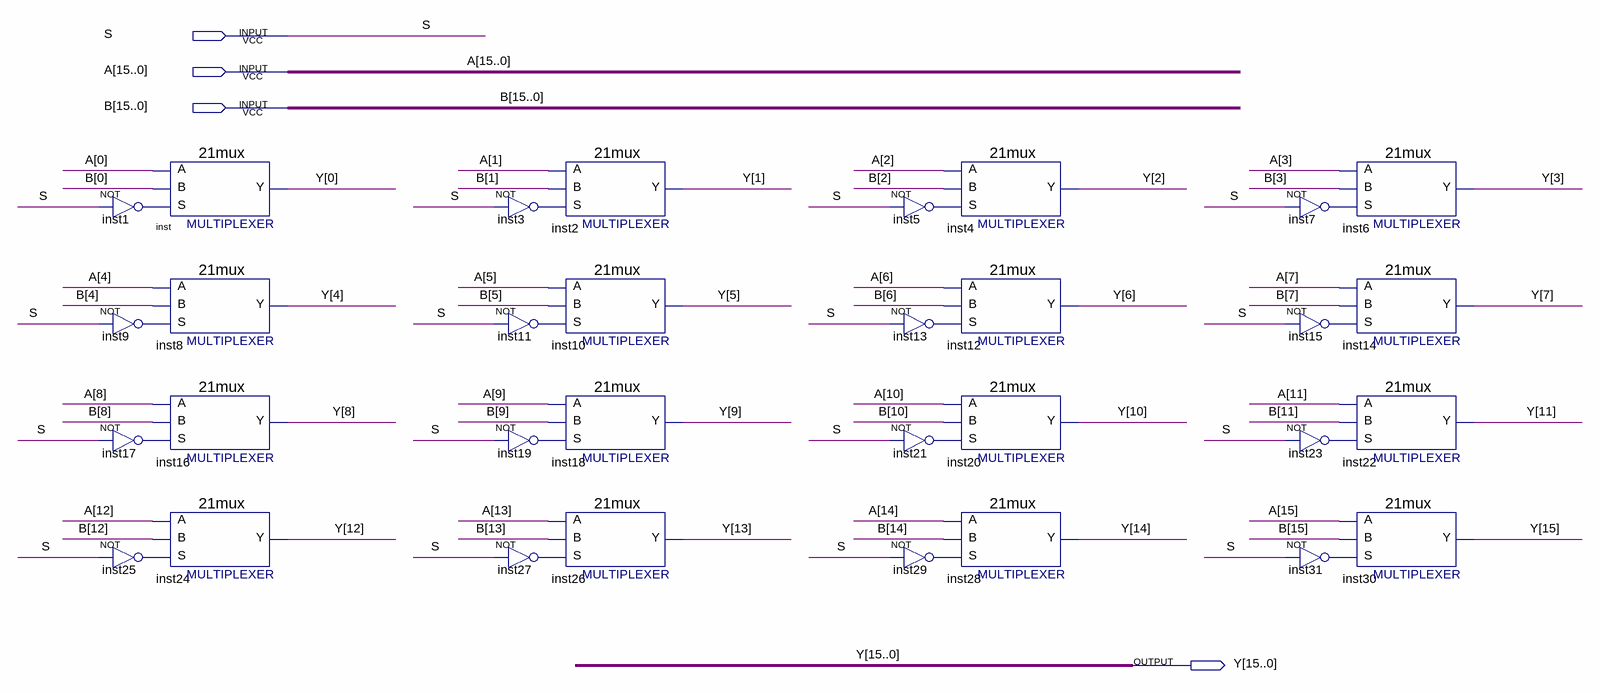
[diagram p0: schematic sheet]
// Quartus schematic mux21_16bit.bdf as structural Verilog: 32 symbols, 4 pins
module mux21_16bit (
  input  S,
  input  [15:0] A,
  input  [15:0] B,
  output [15:0] Y
);

  wire inst1_out, inst3_out, inst5_out, inst7_out, inst9_out, inst11_out, inst13_out, inst15_out, inst17_out,
       inst19_out, inst21_out, inst23_out, inst25_out, inst27_out, inst29_out, inst31_out;

  not inst1 (inst1_out, S);
  not inst9 (inst9_out, S);
  not inst17 (inst17_out, S);
  not inst25 (inst25_out, S);
  \21mux  inst (.S(inst1_out), .B(B[0]), .A(A[0]), .Y(Y[0]));
  \21mux  inst8 (.S(inst9_out), .B(B[4]), .A(A[4]), .Y(Y[4]));
  \21mux  inst16 (.S(inst17_out), .B(B[8]), .A(A[8]), .Y(Y[8]));
  \21mux  inst24 (.S(inst25_out), .B(B[12]), .A(A[12]), .Y(Y[12]));
  not inst3 (inst3_out, S);
  not inst11 (inst11_out, S);
  not inst19 (inst19_out, S);
  not inst27 (inst27_out, S);
  \21mux  inst2 (.S(inst3_out), .B(B[1]), .A(A[1]), .Y(Y[1]));
  \21mux  inst10 (.S(inst11_out), .B(B[5]), .A(A[5]), .Y(Y[5]));
  \21mux  inst18 (.S(inst19_out), .B(B[9]), .A(A[9]), .Y(Y[9]));
  \21mux  inst26 (.S(inst27_out), .B(B[13]), .A(A[13]), .Y(Y[13]));
  not inst5 (inst5_out, S);
  not inst13 (inst13_out, S);
  not inst21 (inst21_out, S);
  not inst29 (inst29_out, S);
  \21mux  inst4 (.S(inst5_out), .B(B[2]), .A(A[2]), .Y(Y[2]));
  \21mux  inst12 (.S(inst13_out), .B(B[6]), .A(A[6]), .Y(Y[6]));
  \21mux  inst20 (.S(inst21_out), .B(B[10]), .A(A[10]), .Y(Y[10]));
  \21mux  inst28 (.S(inst29_out), .B(B[14]), .A(A[14]), .Y(Y[14]));
  not inst7 (inst7_out, S);
  not inst15 (inst15_out, S);
  not inst23 (inst23_out, S);
  not inst31 (inst31_out, S);
  \21mux  inst6 (.S(inst7_out), .B(B[3]), .A(A[3]), .Y(Y[3]));
  \21mux  inst14 (.S(inst15_out), .B(B[7]), .A(A[7]), .Y(Y[7]));
  \21mux  inst22 (.S(inst23_out), .B(B[11]), .A(A[11]), .Y(Y[11]));
  \21mux  inst30 (.S(inst31_out), .B(B[15]), .A(A[15]), .Y(Y[15]));
endmodule
